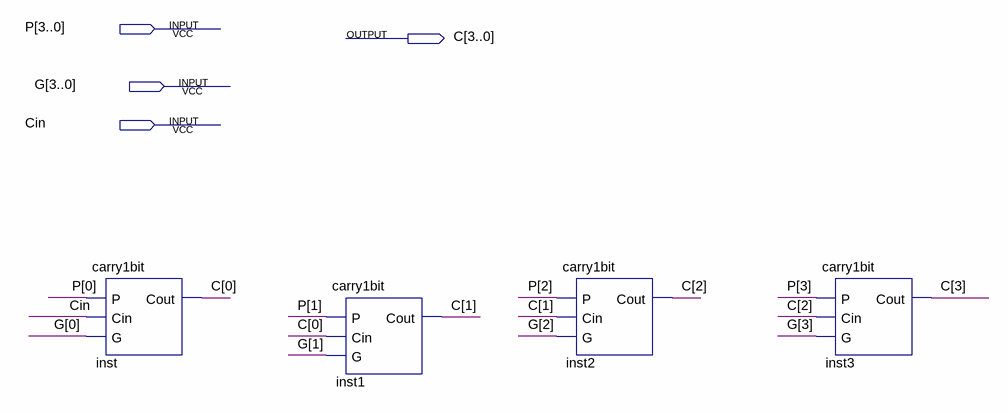
[diagram p0: schematic sheet]
// Quartus schematic carry4bit.bdf as structural Verilog: 4 symbols, 4 pins
module carry4bit (
  input  [3:0] P,
  input  [3:0] G,
  input  Cin,
  output [3:0] C
);

  carry1bit inst (.P(P[0]), .Cin(Cin), .G(G[0]), .Cout(C[0]));
  carry1bit inst1 (.P(P[1]), .Cin(C[0]), .G(G[1]), .Cout(C[1]));
  carry1bit inst2 (.P(P[2]), .Cin(C[1]), .G(G[2]), .Cout(C[2]));
  carry1bit inst3 (.P(P[3]), .Cin(C[2]), .G(G[3]), .Cout(C[3]));
endmodule
